# Altium schematic sheet 二合一正反转(改).SchDoc
size A3
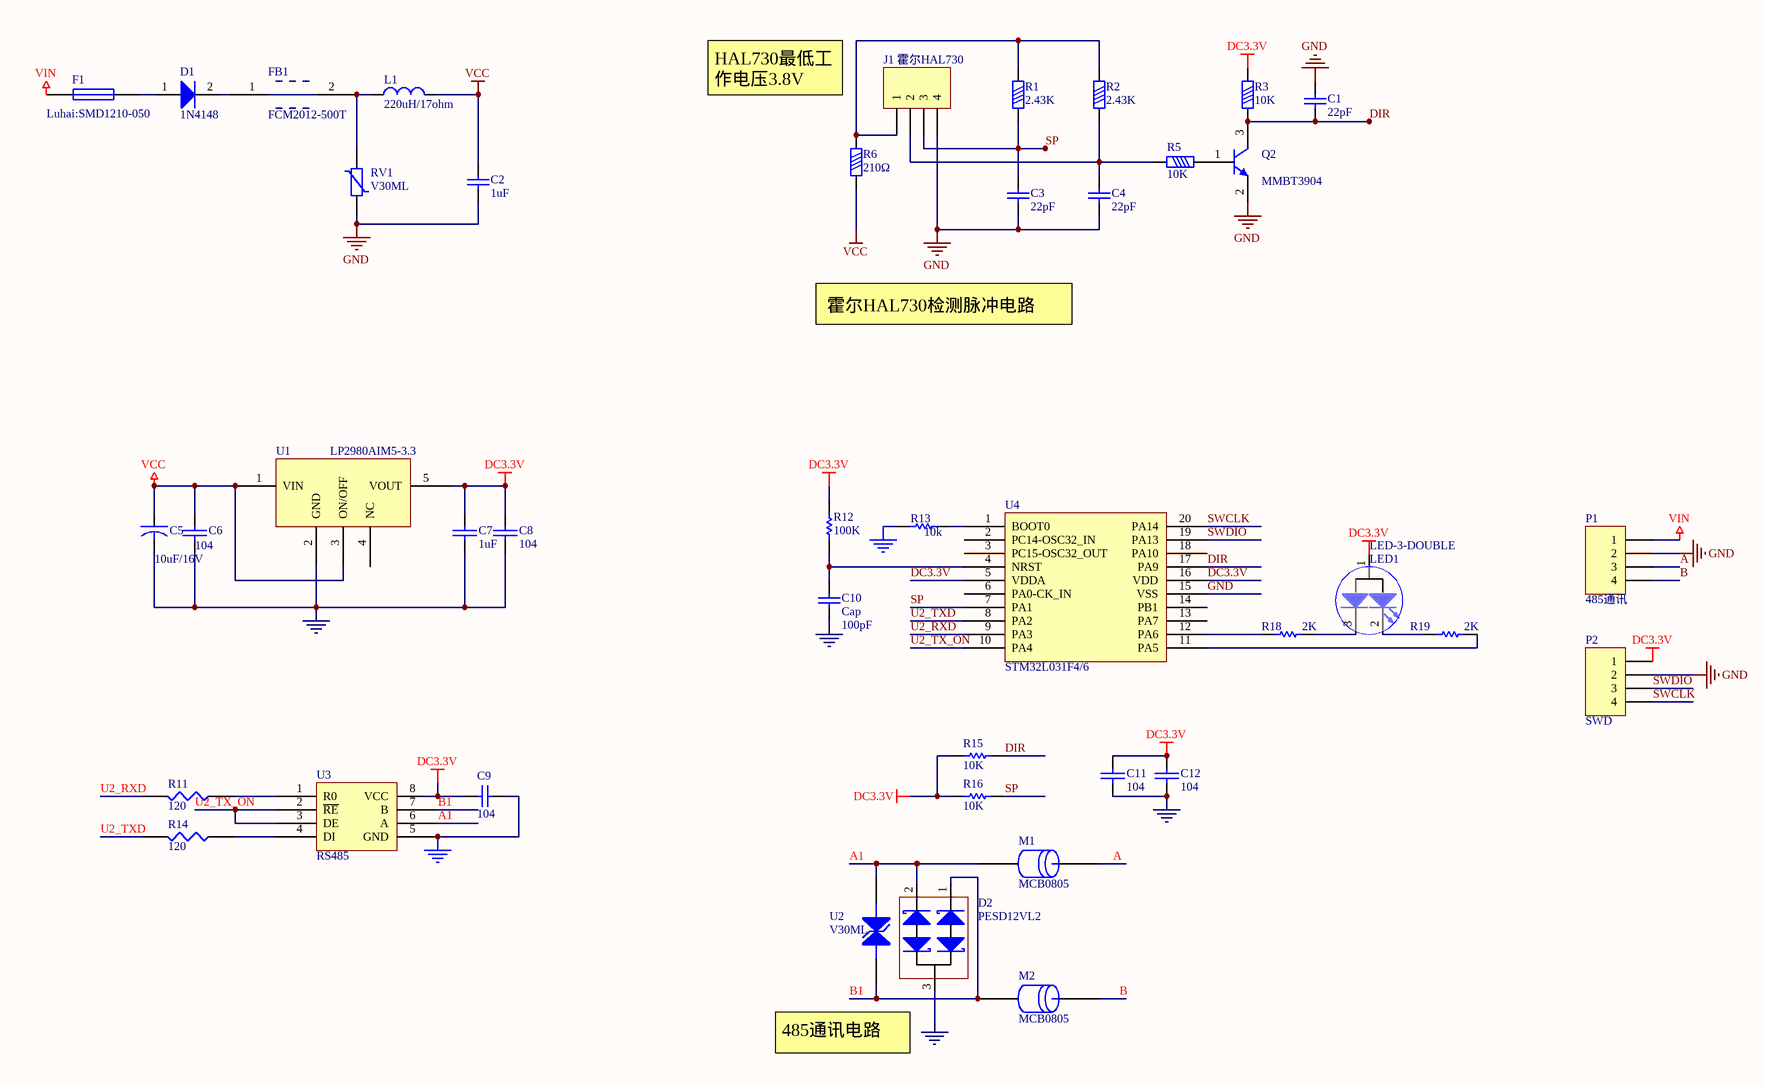
[diagram p0: 二合一正反转(改).SchDoc]

## Parts
C1  value 22pF  [0603C]  (hidden comment: Cap Chip 0603)
C2  1uF  [0805C]
C3  value 22pF  [0603C]  (hidden comment: Cap Chip 0603)
C4  value 22pF  [0603C]  (hidden comment: Cap Chip 0603)
C5  10uF/16V  [A3216]
C6  104  [0603C]
C7  1uF  [0603C]
C8  104  [0603C]
C9  104  [0603C]
C10  Cap  value 100pF  [0603C]
C11  104  [0603C]
C12  104  [0603C]
D1  1N4148  [1N4148]
D2  PESD12VL2  [SOT23]
F1  Luhai:SMD1210-050  [1210R]
FB1  FCM2012-500T  [FB]
J1  霍尔HAL730  [HDR1X4]
L1  220uH/17ohm  [220uH/17ohm]
LED1  LED-3-DOUBLE  [LED-R3-H5-DOUBLE]
M1  MCB0805  [0805F]
M2  MCB0805  [0805F]
P1  485通讯  [HDR1X4]
P2  SWD  [MHDR1X4]
Q2  MMBT3904  [MMBT3904]
R1  value 2.43K  [0603C]  (hidden comment: Resistor Chip 0603)
R2  value 2.43K  [0603C]  (hidden comment: Resistor Chip 0603)
R3  value 10K  [0603C]  (hidden comment: Resistor Chip 0603)
R5  value 10K  [0603C]  (hidden comment: Resistor Chip 0603)
R6  value 210Ω  [0603C]  (hidden comment: Resistor Chip 0603)
R11  120  [0603R]
R12  100K  [0603R]
R13  10k  [0603R]
R14  120  [0603R]
R15  10K  [0603R]
R16  10K  [0603R]
R18  2K  [0603R]
R19  2K  [0603R]
RV1  V30ML  [RV]
U1  LP2980AIM5-3.3  [SOT23-5]
U2  V30ML  [0805C-E]
U3  RS485  [SOP8]
U4  STM32L031F4/6  [TSSOP20]

## Nets
DC3.3V: C7.1 C8.1 C9.1 C11.1 C12.1 LED1.1(K) P2.1 R3.2 R12.1 R15.2 R16.1 U1.5(VOUT) U3.8(VCC) U4.5(VDDA) U4.16(VDD)
GND: C1.2 C2.1 C3.1 C4.1 C5.2 C6.2 C7.2 C8.2 C9.2 C10.1 C11.2 C12.2 D2.3 J1.4 P1.2 P2.2 Q2.2(E) R13.2 RV1.1 U1.2(GND) U3.5(GND) U4.15(VSS)
VCC: C2.2 C5.1 C6.1 L1.2 R6.2 U1.1(VIN) U1.3(ON/OFF)
VIN: F1.1 P1.1
A: M1.2 P1.3
A1: D2.2 M1.1 U2.2 U3.6(A)
B: M2.2 P1.4
B1: D2.1 M2.1 U2.1 U3.7(B)
DIR: C1.1 Q2.3(C) R3.1 R15.1 U4.17(PA9)
SP: C3.2 J1.3 R1.1 R16.2 U4.7(PA1)
SWCLK: P2.4 U4.20(PA14)
SWDIO: P2.3 U4.19(PA13)
U2_RXD: R11.2 U4.9(PA3)
U2_TX_ON: U3.2(~{RE}) U3.3(DE) U4.10(PA4)
U2_TXD: R14.2 U4.8(PA2)
NetC4_2: C4.2 J1.2 R2.1 R5.2
NetC10_2: C10.2 R12.2 U4.4(NRST)
NetD1_1: D1.1(A) F1.2
NetD1_2: D1.2(K) FB1.1
NetFB1_2: FB1.2 L1.1 RV1.2
NetJ1_1: J1.1 R1.2 R2.2 R6.1
NetLED1_2: LED1.2(A) R19.1
NetLED1_3: LED1.3(A) R18.2
NetQ2_1: Q2.1(B) R5.1
NetR11_1: R11.1 U3.1(R0)
NetR13_1: R13.1 U4.1(BOOT0)
NetR14_1: R14.1 U3.4(DI)
NetR18_1: R18.1 U4.12(PA6)
NetR19_2: R19.2 U4.11(PA5)

Not connected (* = marked no-connect by the designer): U1 4(NC); U4 2(PC14-OSC32_IN) 3(PC15-OSC32_OUT) 6(PA0-CK_IN) 13(PA7) 14(PB1) 18(PA10)

## Notes on the sheet
- HAL730最低工作电压3.8V
- 霍尔HAL730检测脉冲电路
- 485通讯电路

## Library data of the parts
C1 C3 C4 = Cap Chip 0603: Polarized Capacitor (Radial); Published: 8-Jun-2000; Revision: July-2002: Re-released for DXP Platform.; Publisher: Altium Limited
C2 = Cap Chip 0805: Polarized Capacitor (Radial); Value: 104; Published: 8-Jun-2000; Revision: July-2002: Re-released for DXP Platform.; Publisher: Altium Limited
C5 = CAPACITOR
C6-C8 C11 C12 = CAP: Capacitor
C9 C10 = Cap: Capacitor
  C9: Published: *; LatestRevisionDate: *; LatestRevisionNote: *; PackageReference: *; Publisher: *; Value: *
  C10: Published: 8-Jun-2000; LatestRevisionDate: 17-Jul-2002; LatestRevisionNote: Re-released for DXP Platform.; PackageReference: RAD-0.3; Publisher: Altium Limited
D2 = TVS
F1 = Fuse 1: Fuse; Published: 8-Jun-2000; LatestRevisionDate: 17-Jul-2002; LatestRevisionNote: Re-released for DXP Platform.; PackageReference: PIN-W2/E2.8; Publisher: Altium Limited; PackageDescription: Thru-Hole; 2 Leads
J1 P2 = Header 4: Header, 4-Pin; LatestRevisionDate: 17-Jul-2002; LatestRevisionNote: Re-released for DXP Platform.; Publisher: Altium Limited
LED1 = DOUB-LED
M1 M2 = MAGNETIC BEAD
P1 = Header 4H: Header, 4-Pin, Right Angle; LatestRevisionDate: 17-Jul-2002; LatestRevisionNote: Re-released for DXP Platform.; Publisher: Altium Limited
R1-R3 R5 R6 = Resistor Chip 0603: Resistor; Published: 8-Jun-2000; Revision: July-2002: Re-released for DXP Platform.; Publisher: Altium Limited
R11 R14 = RES1
R12 R13 R15 R16 = Res1: Resistor; Published: 8-Jun-2000; LatestRevisionDate: 17-Jul-2002; LatestRevisionNote: Re-released for DXP Platform.; Publisher: Altium Limited
R18 R19 = Res1: Resistor; Value: 1K; Published: 8-Jun-2000; LatestRevisionDate: 17-Jul-2002; LatestRevisionNote: Re-released for DXP Platform.; PackageReference: AXIAL-0.3; Publisher: Altium Limited; PackageDescription: Axial Device, Thru-Hole; 2 Leads; 0.3 in Pin Spacing